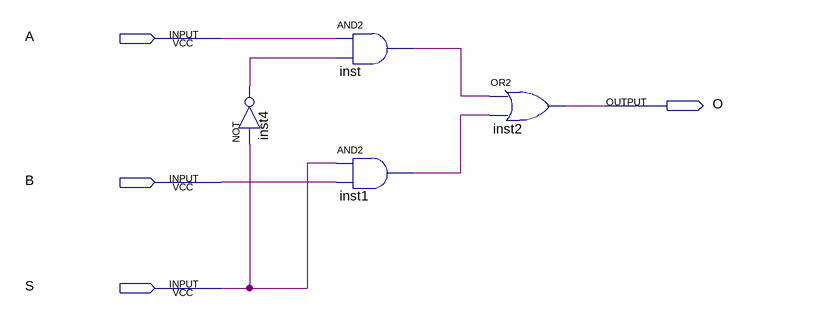
[diagram p0: schematic sheet]
// Quartus schematic 2to1_Mux.bdf as structural Verilog: 4 symbols, 4 pins
module \2to1_Mux  (
  input  A,
  input  B,
  input  S,
  output O
);

  wire inst1_out, inst4_out, inst_out;

  not inst4 (inst4_out, S);
  and inst (inst_out, A, inst4_out);
  and inst1 (inst1_out, S, B);
  or inst2 (O, inst_out, inst1_out);
endmodule
